# Altium schematic sheet Stepper_control.SchDoc
size 139 x 101 mm; SheetNumber: 2; SheetTotal: 6
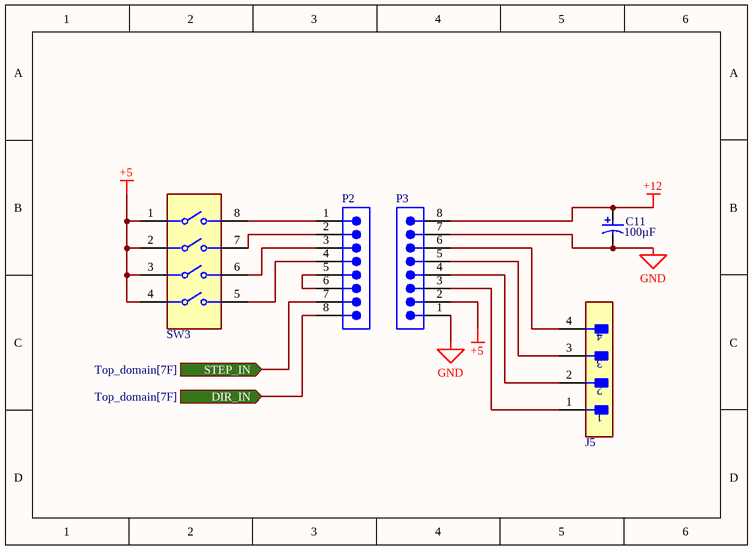
[diagram p0: Stepper_control.SchDoc]

## Parts
C11  Capacitance: 100µF  [PNSC-FK-V-D8_V]  (hidden comment: EEEFK1E101XP)
J5  B4B-XH-A(LF)(SN)  [FP-B4B-XH-A_LF_SN-MFG]  (value not drawn)
P2  61300811121  [61300811121]  (value not drawn)
P3  61300811121  [61300811121]  (value not drawn)
SW3  1825360-3  [FP-1825360-3-MFG]  (value not drawn)

## Ports
DIR_IN (in, see Top_domain[7F]), STEP_IN (in, see Top_domain[7F])

## Nets
+5: P3.2 SW3.1 SW3.2 SW3.3 SW3.4
+12: C11.1 P3.8
GND: C11.2 P3.1 P3.7
DIR_IN: P2.8 ; port DIR_IN
STEP_IN: P2.7 ; port STEP_IN
NetJ5_1: J5.1 P3.3
NetJ5_2: J5.2 P3.4
NetJ5_3: J5.3 P3.5
NetJ5_4: J5.4 P3.6
NetP2_1: P2.1 SW3.8
NetP2_2: P2.2 SW3.7
NetP2_3: P2.3 SW3.6
NetP2_4: P2.4 SW3.5
NetP2_5: P2.5 P2.6

## Library data of the parts
C11 = CMP-2000-06206-1: Aluminum Electrolytic Capacitor, 100 uF, +/- 20%, 25 V, 2-Pin SMD (Size Code D8), -55 to 105 degC, RoHS, Tape and Reel; Manufacturer: Panasonic; Type: Can; Lifetime@Temperature: 2000Hrs@105°C; Rated Voltage: 25V; Ripple Current: 280mA; Impedance: 0.34O; Case Size/Dimension: Ø6.3x7.7mm; Operating Temp-Max: 105°C; Series: FK; Package URL: http://industrial.panasonic.com/cdbs/www-data/pdf/RDE0000/DME0000COL48.pdf; Mounting Technology: SurfaceMount; Package Description: 2-Pin Electrolytic Aluminum Capacitor, Body 6.6 x 6.6 mm; Datasheet Version: 03/2016; Datasheet URL: http://industrial.panasonic.com/cdbs/www-data/pdf/RDE0000/ABA0000C1181.pdf; Manufacturer URL: http://www.panasonic.com/; Package Reference: FK-V-D8; Operating Temp Range: -55to+105°C
J5 = CMP-17439-000250-1: CONN HEADER VERT 4POS 2.5MM; Number of Contacts: 4; Contact Resistance: 20mR; Voltage Rating: 250V; Max Current Rating: 3A; Gender: Male; Wire/Cable Gauge: 22AWG; Mated Stacking Heights: 9.8mm; Insulation Resistance: 1GR; Orientation: Straight; Contact Type: Male Pin; Contact Finish - Mating: TIN; Series: XH; Max Voltage Rating (AC): 250V; Lead Pitch: 2.5mm; Contact Shape: Square; Insulation Color: Natural; Termination: Solder; Lead Free: Lead Free; Voltage Rating (AC): 250V; Number of Rows: 1; Flammability Rating: UL94 V-0; Number of Positions: 4; Max Operating Temperature: 85°C; Package Quantity: 500; Mount: Through Hole; REACH SVHC: No SVHC; Connector Type: Header; Insulation Material: Nylon; Fastening Type: Detent; Min Operating Temperature: -25°C; Housing Color: White; Packaging: Bulk; Contact Plating: Tin; Contact Material: Brass; Max Voltage Rating (DC): 250V; Housing Material: Polyamide; Color: Natural; Material: Polyamide; Pitch: 2.5mm; Depth: 5.75mm; Current Rating: 3A; Length: 12.4mm
P2 P3 = CMP-1502-01076-2: NexarPartId: 32855533; Current Rating: 3A; Connector Type: Male Pin; Voltage Rating: 250V; Number of Contacts: 8; Pitch: 2.54mm; Contact Resistance: 20mΩ; Gender: Male; REACH SVHC: Unknown; Number of Rows: 1; Mount: Through Hole; Termination: Solder; Number of Pins: 8; Number of Positions: 8; Height: 8.54mm; Contact Mating Length: 5.9944mm; Orientation: Vertical; Operating Supply Voltage: 250V; Min Operating Temperature: -40°C; Max Operating Temperature: 105°C; Packaging: Bulk; Color: Black; Lead Pitch: 2.54mm; RoHS: Compliant; Contact Material: Copper; Contact Plating: Gold
SW3 = CMP-03400-000022-1: SWITCH SLIDE DIP SPST 100MA 24V; Washable: Yes; Contact Current Rating: 1A; Electrical Life: 1000Cycles; Number of Circuits: 4; Pitch: 0.1inch; Actuator Length: 0.99mm; Contact Resistance: 50mR; Actuator Type: Standard; Contact Post Length: 4mm; Voltage Rating (DC): 5V; Actuator Material: Polybutylene; Sealable: No (Without); Max Voltage Rating (DC): 24V; Throw Configuration: SPST; Mount: Through Hole; Type: Switch; RoHS Compliant: Yes; Min Operating Temperature: -30°C; Max Operating Temperature: 85°C; Orientation: Straight; Packaging: Rail/Tube; Series: ADE; Lead Free: Lead Free; Depth: 7.49mm; Flammability Rating: UL94 V-0; Radiation Hardening: No; Terminal Pitch: 2.54mm; Package Quantity: 35; Contact Material: Copper Alloy; Housing Color: Black; Number of Positions: 4; Length: 0.476inch; ELV: Compliant; Termination: PC Pins; Housing Material: Polyphenylene; Contact Plating: Gold; Max Current Rating: 100mA; Height: 0.138inch